# Altium project motor_driver_and_wireless_power_PCB.PrjPCB
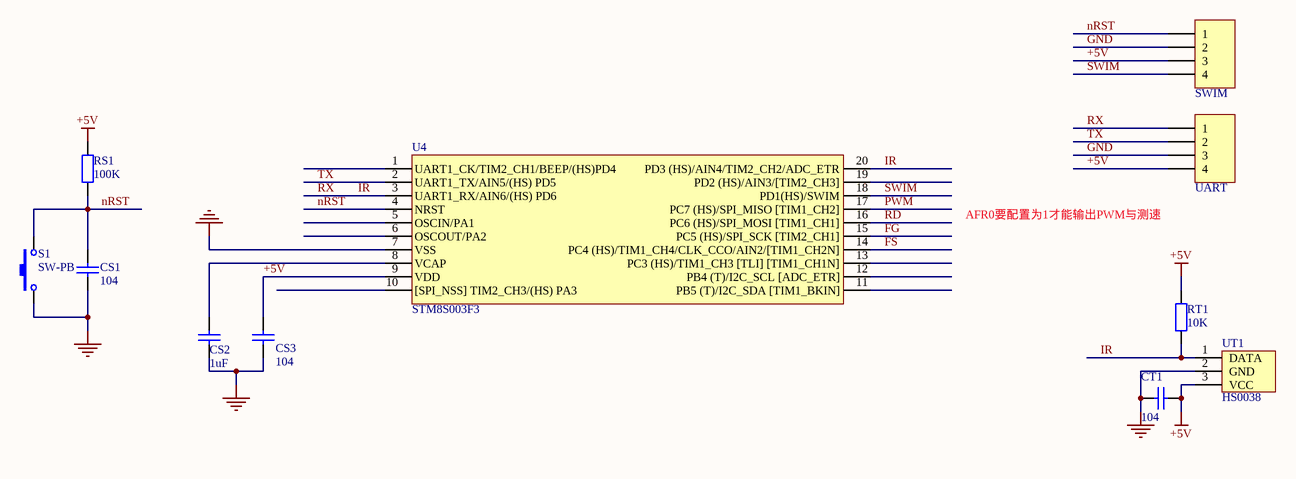
[diagram p0: stm8s003f3.SchDoc]
3 sheets, 43 parts. Net scope: global (net labels, ports and power ports of the same name join across sheets).
Board file: motor_driver_and_wireless_power_PCB.PcbDoc
Sheets:
  stm8s003f3.SchDoc
  motor_driver.SchDoc
  power.SchDoc

## Sheet stm8s003f3.SchDoc
size A4

### Parts
CS1  value 104  [CAPC1608N]  (hidden comment: Cap1)
CS2  value 1uF  [CAPC1608N]  (hidden comment: Cap1)
CS3  value 104  [CAPC1608N]  (hidden comment: Cap1)
CT1  value 104  [CAPC1608N]  (hidden comment: Cap1)
RS1  value 100K  [RESC1608N]  (hidden comment: Res1)
RT1  value 10K  [RESC1608N]  (hidden comment: Res1)
S1  SW-PB  [SW-3x6]
SWIM  Header 4  [HDR1X4]  (value not drawn)
U4  STM8S003F3  [TSSOP20_N]
UART  Header 4  [HDR1X4]  (value not drawn)
UT1  HS0038  [HS0038]

### Nets
+5V: CS3.2 CT1.1 RS1.2 RT1.1 SWIM.3 U4.9(VDD) UART.4 UT1.3(VCC)
GND: CS1.1 CS2.1 CS3.1 CT1.2 S1.1 SWIM.2 U4.7(VSS) UART.3 UT1.2(GND)
FG: U4.15(PC5_(HS)/SPI_SCK_[TIM2_CH1])
FS: U4.14(PC4_(HS)/TIM1_CH4/CLK_CCO/AIN2/[TIM1_CH2N])
IR: RT1.2 U4.3(UART1_RX/AIN6/(HS)_PD6) U4.20(PD3_(HS)/AIN4/TIM2_CH2/ADC_ETR) UART.1 UT1.1(DATA)  [also labelled RX]
nRST: CS1.2 RS1.1 S1.2 SWIM.1 U4.4(NRST)
PWM: U4.17(PC7_(HS)/SPI_MISO_[TIM1_CH2])
RD: U4.16(PC6_(HS)/SPI_MOSI_[TIM1_CH1])
SWIM: SWIM.4 U4.18(PD1(HS)/SWIM)
TX: U4.2(UART1_TX/AIN5/(HS)_PD5) UART.2
NetCS2_2: CS2.2 U4.8(VCAP)

Not connected (* = marked no-connect by the designer): U4 1(UART1_CK/TIM2_CH1/BEEP/(HS)PD4) 5(OSCIN/PA1) 6(OSCOUT/PA2) 10([SPI_NSS]_TIM2_CH3/(HS)_PA3) 11(PB5_(T)/I2C_SDA_[TIM1_BKIN]) 12(PB4_(T)/I2C_SCL_[ADC_ETR]) 13(PC3_(HS)/TIM1_CH3_[TLI]_[TIM1_CH1N]) 19(PD2_(HS)/AIN3/[TIM2_CH3])

### Notes on the sheet
- AFR0要配置为1才能输出PWM与测速

### Library data of the parts
CS1-CS3 CT1 = Cap1: Capacitor; Published: 8-Jun-2000; LatestRevisionDate: 17-Jul-2002; LatestRevisionNote: Re-released for DXP Platform.; PackageReference: RAD-0.3; Publisher: Altium Limited
RS1 RT1 = Res1: Resistor; Published: 8-Jun-2000; LatestRevisionDate: 17-Jul-2002; LatestRevisionNote: Re-released for DXP Platform.; PackageReference: AXIAL-0.4; Publisher: Altium Limited
S1 = SW-PB: Switch; Published: 24-Mar-1999; LatestRevisionDate: 17-Jul-2002; LatestRevisionNote: Re-released for DXP Platform.; PackageReference: SPST-2; Publisher: Altium Limited; PackageDescription: Switch; 2 Leads
SWIM UART = Header 4: Header, 4-Pin; LatestRevisionDate: 17-Jul-2002; LatestRevisionNote: Re-released for DXP Platform.; Publisher: Altium Limited

## Sheet motor_driver.SchDoc
size A4
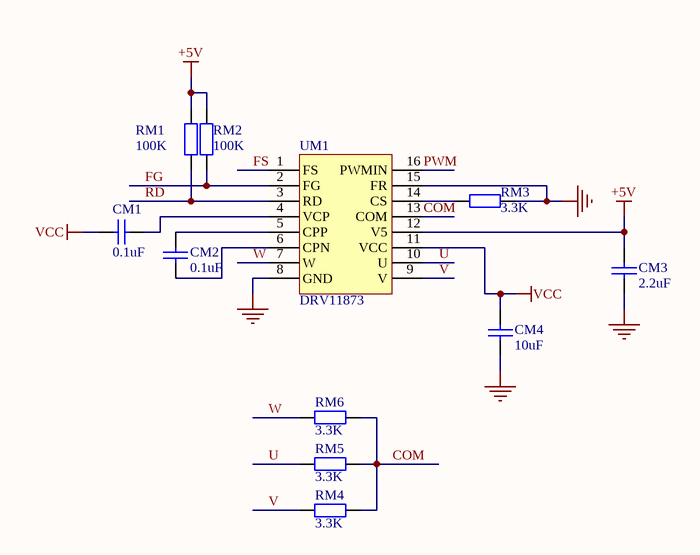
[diagram p1: motor_driver.SchDoc]

### Parts
CM1  value 0.1uF  [CAPC1608N]  (hidden comment: Cap1)
CM2  value 0.1uF  [CAPC1608N]  (hidden comment: Cap1)
CM3  value 2.2uF  [CAPC1608N]  (hidden comment: Cap1)
CM4  value 10uF  [CAPC1608N]  (hidden comment: Cap1)
RM1  value 100K  [RESC1608N]  (hidden comment: Res1)
RM2  value 100K  [RESC1608N]  (hidden comment: Res1)
RM3  value 3.3K  [RESC1608N]  (hidden comment: Res1)
RM4  value 3.3K  [RESC1608N]  (hidden comment: Res1)
RM5  value 3.3K  [RESC1608N]  (hidden comment: Res1)
RM6  value 3.3K  [RESC1608N]  (hidden comment: Res1)
UM1  DRV11873  [TSSOP-16N]

### Nets
+5V: CM3.1 RM1.2 RM2.2 UM1.12(V5)
GND: CM3.2 CM4.2 RM3.1 UM1.8(GND) UM1.15(FR)
VCC: CM1.2 CM4.1 UM1.11(VCC)
COM: RM4.2 RM5.2 RM6.2 UM1.13(COM)
FG: RM2.1 UM1.2(FG)
FS: UM1.1(FS)
PWM: UM1.16(PWMIN)
RD: RM1.1 UM1.3(RD)
U: RM5.1 UM1.10(U)
V: RM4.1 UM1.9(V)
W: RM6.1 UM1.7(W)
NetCM1_1: CM1.1 UM1.4(VCP)
NetCM2_1: CM2.1 UM1.5(CPP)
NetCM2_2: CM2.2 UM1.6(CPN)
NetRM3_2: RM3.2 UM1.14(CS)

### Library data of the parts
CM1-CM4 = Cap1: Capacitor; Published: 8-Jun-2000; LatestRevisionDate: 17-Jul-2002; LatestRevisionNote: Re-released for DXP Platform.; PackageReference: RAD-0.3; Publisher: Altium Limited
RM1-RM6 = Res1: Resistor; Published: 8-Jun-2000; LatestRevisionDate: 17-Jul-2002; LatestRevisionNote: Re-released for DXP Platform.; PackageReference: AXIAL-0.4; Publisher: Altium Limited
UM1 = DRV11873: 三相无传感器、 无刷直流 (BLDC) 电机驱动器

## Sheet power.SchDoc
size A4
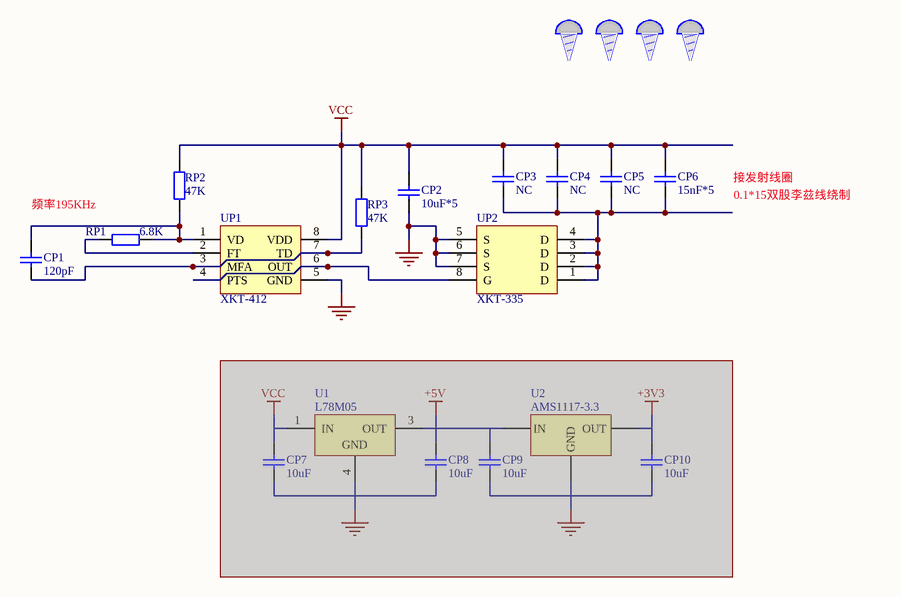
[diagram p2: power.SchDoc]

### Parts
CP1  value 120pF  [CAPC1608N]  (hidden comment: Cap1)
CP2  value 10uF*5  [CAPC1608N]  (hidden comment: Cap1)
CP3  value NC  [CAPC1608N]  (hidden comment: Cap1)
CP4  value NC  [CAPC1608N]  (hidden comment: Cap1)
CP5  value NC  [CAPC1608N]  (hidden comment: Cap1)
CP6  value 15nF*5  [CAPC1608N]  (hidden comment: Cap1)
CP7  value 10uF  [CAPC2012N]  (hidden comment: Cap1)  (masked out: inside a compile mask, not in the netlist)
CP8  value 10uF  [CAPC2012N]  (hidden comment: Cap1)  (masked out: inside a compile mask, not in the netlist)
CP9  value 10uF  [CAPC2012N]  (hidden comment: Cap1)  (masked out: inside a compile mask, not in the netlist)
CP10  value 10uF  [CAPC2012N]  (hidden comment: Cap1)  (masked out: inside a compile mask, not in the netlist)
M1  M  [TAPPING HOLE]  (value not drawn)
M2  M  [TAPPING HOLE]  (value not drawn)
M3  M  [TAPPING HOLE]  (value not drawn)
M4  M  [TAPPING HOLE]  (value not drawn)
RP1  value 6.8K  [RESC1608N]  (hidden comment: Res1)
RP2  value 47K  [RESC1608N]  (hidden comment: Res1)
RP3  value 47K  [RESC1608N]  (hidden comment: Res1)
U1  L78M05  [TO-252]  (masked out: inside a compile mask, not in the netlist)
U2  AMS1117-3.3  [SOT-223_N]  (masked out: inside a compile mask, not in the netlist)
UP1  XKT-412  [SOP8_L]
UP2  XKT-335  [SOP8_L]

### Nets
GND: CP2.1 UP1.5(GND) UP2.5(S) UP2.6(S) UP2.7(S)
VCC: CP2.2 CP3.2 CP4.2 CP5.2 CP6.2 RP2.2 RP3.2 UP1.8(VDD)
NetCP1_1: CP1.1 RP3.1 UP1.3(MFA) UP1.7(TD)
NetCP1_2: CP1.2 RP1.1 RP2.1 UP1.1(VD)
NetCP3_1: CP3.1 CP4.1 CP5.1 CP6.1 UP2.1(D) UP2.2(D) UP2.3(D) UP2.4(D)
NetRP1_2: RP1.2 UP1.2(FT)
NetUP1_4: UP1.4(PTS) UP1.6(OUT) UP2.8(G)

### Notes on the sheet
- 接发射线圈
- 频率195KHz
- 0.1*15双股李兹线绕制

### Library data of the parts
CP1-CP10 = Cap1: Capacitor; Published: 8-Jun-2000; LatestRevisionDate: 17-Jul-2002; LatestRevisionNote: Re-released for DXP Platform.; PackageReference: RAD-0.3; Publisher: Altium Limited
RP1-RP3 = Res1: Resistor; Published: 8-Jun-2000; LatestRevisionDate: 17-Jul-2002; LatestRevisionNote: Re-released for DXP Platform.; PackageReference: AXIAL-0.4; Publisher: Altium Limited
U1 = L78M05: Precision 500mA Regulator; Published: 24-Aug-2001; LatestRevisionDate: 06-Jun-2005; LatestRevisionNote: PCB pads lengthened.; DatasheetVersion: Mar-1997; PackageVersion: Jun-2004; PackageReference: TO-252; Publisher: Altium Limited; PackageDescription: D-PAK/TO-252-AA; 3 Leads (1 Cropped); Body 10.1 (inc. leads) x 6.6 mm (LxW max); ComponentLink1Description: Manufacturer Link; ComponentLink1URL: http://www.st.com/; ComponentLink2Description: Datasheet; ComponentLink2URL: http://www.st.com/stonline/products/literature/ds/2147/l78m05ab.pdf

## Nets that join several sheets
+5V: stm8s003f3 (8 pins), motor_driver (CM3.1 RM1.2 RM2.2 UM1.12)
GND: stm8s003f3 (9 pins), motor_driver (5 pins), power (5 pins)
VCC: motor_driver (CM1.2 CM4.1 UM1.11), power (8 pins)
FG: stm8s003f3 (U4.15), motor_driver (RM2.1 UM1.2)
FS: stm8s003f3 (U4.14), motor_driver (UM1.1)
PWM: stm8s003f3 (U4.17), motor_driver (UM1.16)
RD: stm8s003f3 (U4.16), motor_driver (RM1.1 UM1.3)